# EAGLE design DWM1000 (EAGLE 8.6.0)
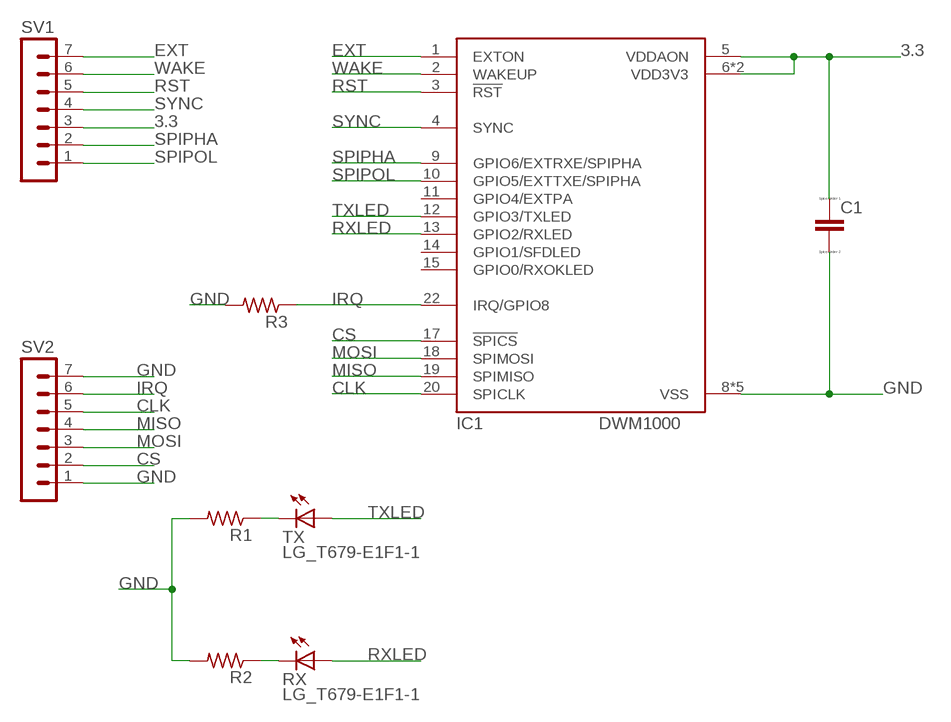
[diagram p0: schematic, sheet 1]

## Parts
C1  CC0504  [C0504]
IC1  DWM1000  [DWM1000]
R1  R-US_M0805  [M0805]
R2  R-US_M0805  [M0805]
R3  R-US_M0805  [M0805]
RX  LG_T679-E1F1-1  [PLCC2]
SV1  MA07-1  [MA07-1]
SV2  MA07-1  [MA07-1]
TX  LG_T679-E1F1-1  [PLCC2]

## Nets
3.3: C1.1 IC1.5(VDDAON) IC1.6(VDD3V3) IC1.7(VDD3V3) SV1.3
CLK: IC1.20(SPICLK) SV2.5
CS: IC1.17(!SPICS) SV2.2
EXT: IC1.1(EXTON) SV1.7
GND: C1.2 IC1.8(VSS) IC1.16(VSS) IC1.21(VSS) IC1.23(VSS) IC1.24(VSS) R1.2 R2.2 R3.2 SV2.1 SV2.7
IRQ: IC1.22(IRQ/GPIO8) R3.1 SV2.6
MISO: IC1.19(SPIMISO) SV2.4
MOSI: IC1.18(SPIMOSI) SV2.3
N$1: R1.1 TX.C
N$2: R2.1 RX.C
RST: IC1.3(!RST) SV1.5
RXLED: IC1.13(GPIO2/RXLED) RX.A
SPIPHA: IC1.9(GPIO6/EXTRXE/SPIPHA) SV1.2
SPIPOL: IC1.10(GPIO5/EXTTXE/SPIPHA) SV1.1
SYNC: IC1.4(SYNC) SV1.4
TXLED: IC1.12(GPIO3/TXLED) TX.A
WAKE: IC1.2(WAKEUP) SV1.6
Unconnected: IC1.11(GPIO4/EXTPA) IC1.14(GPIO1/SFDLED) IC1.15(GPIO0/RXOKLED)

## Library data of the parts
C1 = eagle-ltspice:C: CAPACITOR, European symbol; SPICEMODEL: NONE; SPICEPREFIX: C
IC1 = decawave:DWM1000
R1-R3 = rcl:R-US_: RESISTOR, American symbol; SPICEPREFIX: R
RX TX = led:*_T679-?-1: LC TOPLED® Low Current LED Source: http://catalog.osram-os.com .. LG_LS_LY_T679_OBS.pdf; COLOR: green
SV1 SV2 = con-lstb:MA07-1: PIN HEADER; OC_FARNELL: unknown; OC_NEWARK: unknown

## Board
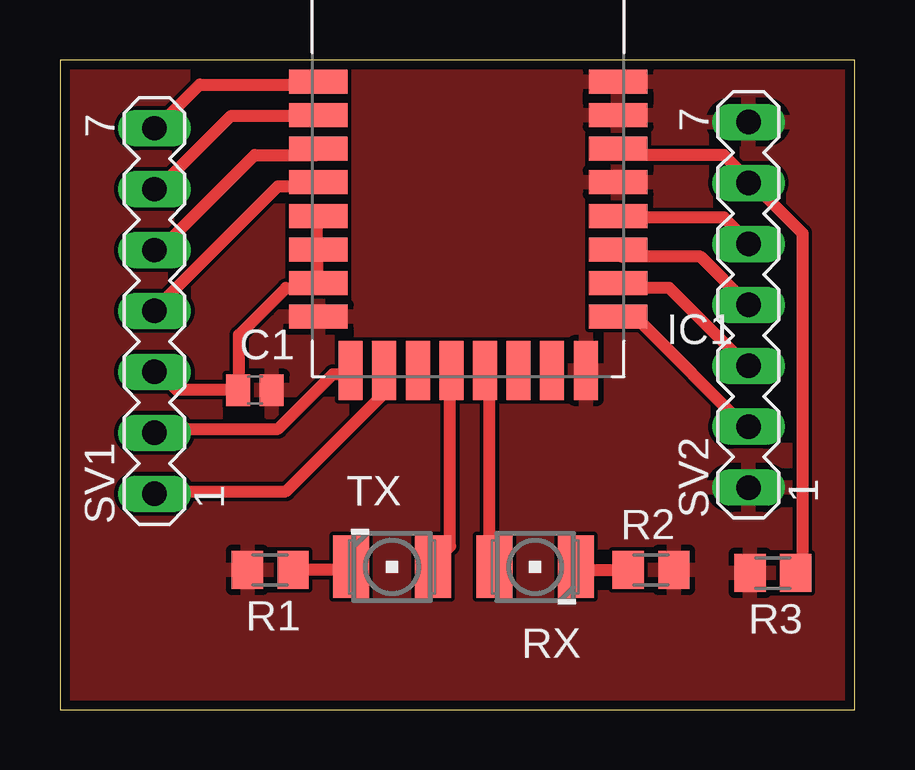
[diagram p1: board, top side]
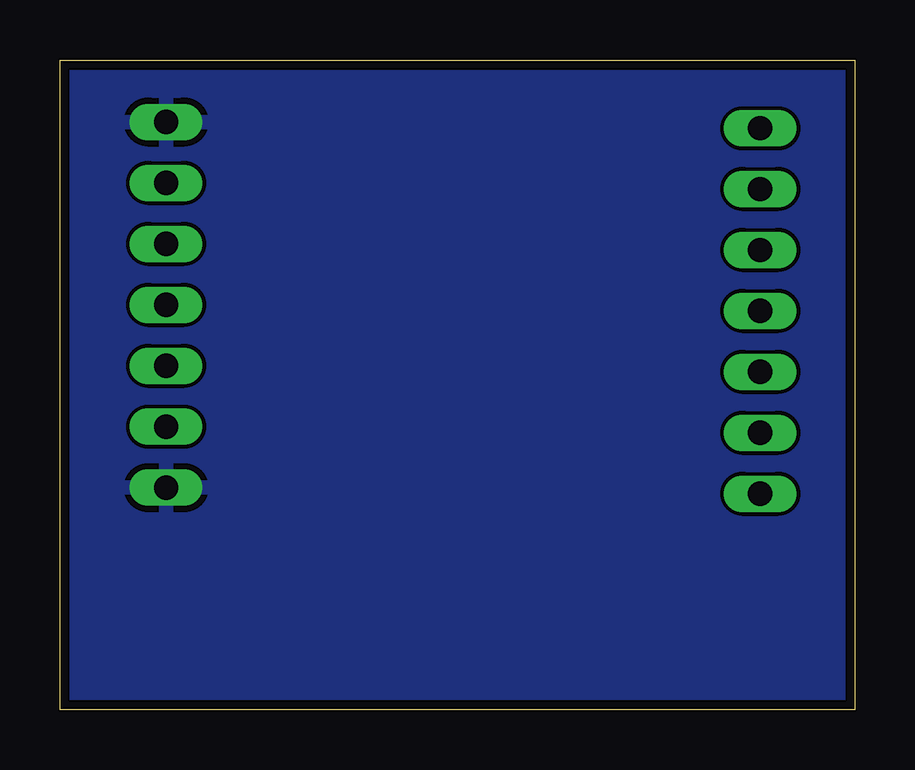
[diagram p2: board, bottom side, seen from below]

Size 33.13 x 27.1 mm. Coordinates in mm from the lower left corner, seen from the top.
Outline: 0,0 33.13,0 33.13,27.1 0,27.1 0,0
Copper layers (1*16): Top 0.035mm / dielectric 1.5mm / Bottom 0.035mm
Design rules "default *": minimum track width 0.5mm, minimum drill 0.35mm, track to track 6mil, track to pad 6mil, pad to pad 6mil, via to via 6mil, smd to smd 6mil, copper to edge 0.4mm, drill to drill 6mil, minimum pad ring 10mil, minimum via ring 8mil, stop-mask expansion 4mil, vias tented up to drill 0mil, thermal gap 10mil

### Footprints (pad centres in the part's own frame; a part is rotated, then mirrored left to right if it is on the bottom)
C0504 = smd 1 x 1.3: 1 -0.7,0; 2 0.7,0
DWM1000 = smd 2.45 x 1: 1 -6.25,0.8; 2 -6.25,-0.6; 3 -6.25,-2; 4 -6.25,-3.4; 5 -6.25,-4.8; 6 -6.25,-6.2; 7 -6.25,-7.6; 8 -6.25,-9; 17 6.25,-9; 18 6.25,-7.6; 19 6.25,-6.2; 20 6.25,-4.8; 21 6.25,-3.4; 22 6.25,-2; 23 6.25,-0.6; 24 6.25,0.8 | smd 1 x 2.45: 9 -4.9,-11.25; 10 -3.5,-11.25; 11 -2.1,-11.25; 12 -0.7,-11.25; 13 0.7,-11.25; 14 2.1,-11.25; 15 3.5,-11.25; 16 4.9,-11.25
M0805 = smd 1.3 x 1.6: 1 -0.95,0; 2 0.95,0
PLCC2 = smd 2.6 x 1.5: A 0,1.7; C 0,-1.7
MA07-1 = drill 1.016 long: 1 -7.62,0; 2 -5.08,0; 3 -2.54,0; 4 0,0; 5 2.54,0; 6 5.08,0; 7 7.62,0

### Placement (x,y rotation side)
C1  8.13,13.34 0 top
IC1  17.02,25.4 0 top
R1  8.76,5.84 180 top
R2  24.64,5.84 0 top
R3  29.72,5.71 180 top
RX  19.81,5.97 90 top
SV1  3.94,16.64 90 top
SV2  28.7,16.89 90 top
TX  13.84,5.97 270 top

### Tracks (layer width: path | path; a pad name or v marks a point on that pad's centre or on a via)
3.3
  Top 0.5: IC1.5 10.72,20.53 10.72,19.23 IC1.6 10.72,18.9 10.72,17.92 IC1.7 10.72,17.59 9.42,17.59 7.46,15.64 7.46,13.35 C1.1 7.14,13.35 4.85,13.35 4.2,14.01 SV1.3
CLK
  Top 0.5: IC1.20 23.45,20.53 27.69,20.53 28.67,19.55 SV2.5
CS
  Top 0.5: IC1.17 23.45,16.29 24.1,16.29 28.67,11.72 SV2.2
EXT
  Top 0.5: IC1.1 10.72,26.08 5.83,26.08 4.2,24.45 SV1.7
GND
  pour Top: -0.25,27.43 33.66,27.43 33.66,-0.51 -0.38,-0.51 -0.38,27.43
  pour Bottom: -0.76,27.94 -0.76,-1.14 34.67,-1.14 34.67,28.57 -0.89,28.57 -0.89,28.19
IRQ
  Top 0.5: R3.1 30.95,5.85 30.95,19.88 28.99,21.84 SV2.6 28.67,22.16 27.69,23.14 23.45,23.14 IC1.22
MISO
  Top 0.5: IC1.19 23.45,18.9 26.71,18.9 28.67,16.94 SV2.4
MOSI
  Top 0.5: IC1.18 23.45,17.59 25.4,17.59 28.67,14.33 SV2.3
N$1
  Top 0.5: R1.1 9.75,5.85 12.03,5.85 TX.C
N$2
  Top 0.5: R2.1 23.45,5.85 21.82,5.85 RX.C
RST
  Top 0.5: IC1.3 10.72,23.14 8.12,23.14 4.2,19.23 SV1.5
RXLED
  Top 0.5: IC1.13 17.9,14.01 17.9,6.18 RX.A
SPIPHA
  Top 0.5: IC1.9 12.03,14.01 11.38,14.01 9.09,11.72 4.2,11.72 SV1.2
SPIPOL
  Top 0.5: IC1.10 13.33,14.01 13.33,13.03 9.42,9.11 4.2,9.11 SV1.1
SYNC
  Top 0.5: IC1.4 10.72,21.84 9.09,21.84 4.2,16.94 SV1.4
TXLED
  Top 0.5: IC1.12 16.27,14.01 16.27,6.83 15.62,6.18 TX.A
WAKE
  Top 0.5: IC1.2 10.72,24.77 7.14,24.77 4.2,21.84 SV1.6